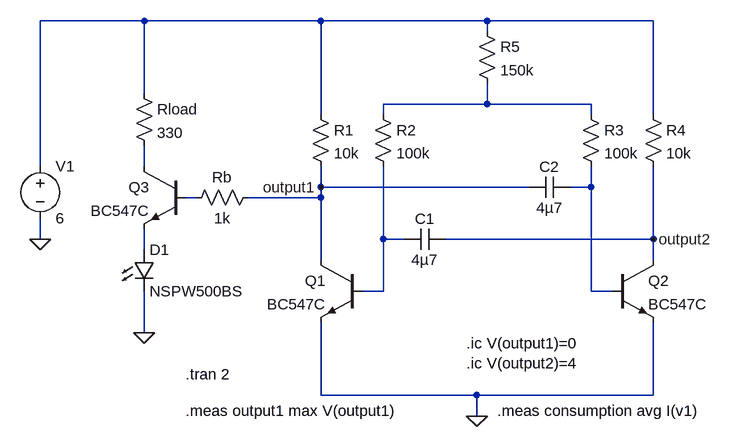
[diagram p0: schematic blinking-final-led.asc]
blinking-final-led.asc, the LTspice schematic file:
Version 4
SHEET 1 880 680
WIRE -480 -80 -640 -80
WIRE -208 -80 -480 -80
WIRE 48 -80 -208 -80
WIRE 304 -80 48 -80
WIRE 48 -64 48 -80
WIRE -480 32 -480 -80
WIRE 48 48 48 16
WIRE 48 48 -112 48
WIRE 208 48 48 48
WIRE -208 64 -208 -80
WIRE -112 64 -112 48
WIRE 208 64 208 48
WIRE 304 64 304 -80
WIRE -640 144 -640 -80
WIRE -480 144 -480 112
WIRE -208 176 -208 144
WIRE 112 176 -208 176
WIRE 208 176 208 144
WIRE 208 176 176 176
WIRE -400 192 -416 192
WIRE -208 192 -208 176
WIRE -208 192 -320 192
WIRE -640 256 -640 224
WIRE -112 256 -112 144
WIRE -80 256 -112 256
WIRE 304 256 304 144
WIRE 304 256 -16 256
WIRE -480 272 -480 240
WIRE -208 288 -208 192
WIRE 304 288 304 256
WIRE -112 336 -112 256
WIRE -112 336 -144 336
WIRE 208 336 208 176
WIRE 240 336 208 336
WIRE -480 400 -480 336
WIRE -208 496 -208 384
WIRE 32 496 -208 496
WIRE 304 496 304 384
WIRE 304 496 32 496
WIRE 32 528 32 496
FLAG 32 528 0
FLAG -640 256 0
FLAG -208 176 output1
FLAG 304 256 output2
FLAG -480 400 0
SYMBOL npn -144 288 M0
SYMATTR InstName Q1
SYMATTR Value BC547C
SYMBOL npn 240 288 R0
SYMATTR InstName Q2
SYMATTR Value BC547C
SYMBOL Cap 176 160 R90
WINDOW 0 0 32 VBottom 2
WINDOW 3 32 32 VTop 2
SYMATTR InstName C2
SYMATTR Value 4µ7
SYMBOL Cap -16 240 R90
WINDOW 0 0 32 VBottom 2
WINDOW 3 32 32 VTop 2
SYMATTR InstName C1
SYMATTR Value 4µ7
SYMBOL Res -128 48 R0
SYMATTR InstName R2
SYMATTR Value 100k
SYMBOL Res 192 48 R0
SYMATTR InstName R3
SYMATTR Value 100k
SYMBOL Res -224 48 R0
SYMATTR InstName R1
SYMATTR Value 10k
SYMBOL Res 288 48 R0
SYMATTR InstName R4
SYMATTR Value 10k
SYMBOL Voltage -640 128 R0
SYMATTR InstName V1
SYMATTR Value 6
SYMBOL npn -416 144 M0
SYMATTR InstName Q3
SYMATTR Value BC547C
SYMBOL LED -496 272 R0
SYMATTR InstName D1
SYMATTR Value NSPW500BS
SYMATTR Description Diode
SYMATTR Type diode
SYMBOL Res -496 16 R0
SYMATTR InstName Rload
SYMATTR Value 330
SYMBOL Res -304 176 R90
WINDOW 0 0 56 VBottom 2
WINDOW 3 32 56 VTop 2
SYMATTR InstName Rb
SYMATTR Value 1k
SYMBOL Res 32 -80 R0
SYMATTR InstName R5
SYMATTR Value 150k
TEXT -416 464 Left 2 !.tran 2
TEXT 16 416 Left 2 !.ic V(output1)=0\n.ic V(output2)=4
TEXT -416 520 Left 2 !.meas output1 max V(output1)
TEXT 64 520 Left 2 !.meas consumption avg I(v1)

The netlist it stands for:
* blinking-final-led.asc
Q1 output1 N006 0 0 BC547C
Q2 output2 N004 0 0 BC547C
C2 N004 output1 4µ7
C1 output2 N006 4µ7
R2 N002 N006 100k
R3 N002 N004 100k
R1 N001 output1 10k
R4 N001 output2 10k
V1 N001 0 6
Q3 N003 N005 N007 0 BC547C
D1 N007 0 NSPW500BS
Rload N001 N003 330
Rb output1 N005 1k
R5 N001 N002 150k
.model D D
.lib standard.dio
.model NPN NPN
.model PNP PNP
.lib standard.bjt
.tran 2
.ic V(output1)=0
.ic V(output2)=4
.meas output1 max V(output1)
.meas consumption avg I(v1)
.backanno
.end